# Altium schematic sheet AUTMan_DXL_SCH.SchDoc: AUTMan USBzDXL Module
size A; DrawnBy: Mojtaba Karimi; Engineer: Mojtaba Karimi; Organization: AUTMan TEAM; Address1: 3 Minna Close; Address2: Amirkabir University of Technology; Address3: Tehran; Address4: IRAN; DocumentNumber: NO.1; Revision: v.1.00; SheetNumber: 1; SheetTotal: 1
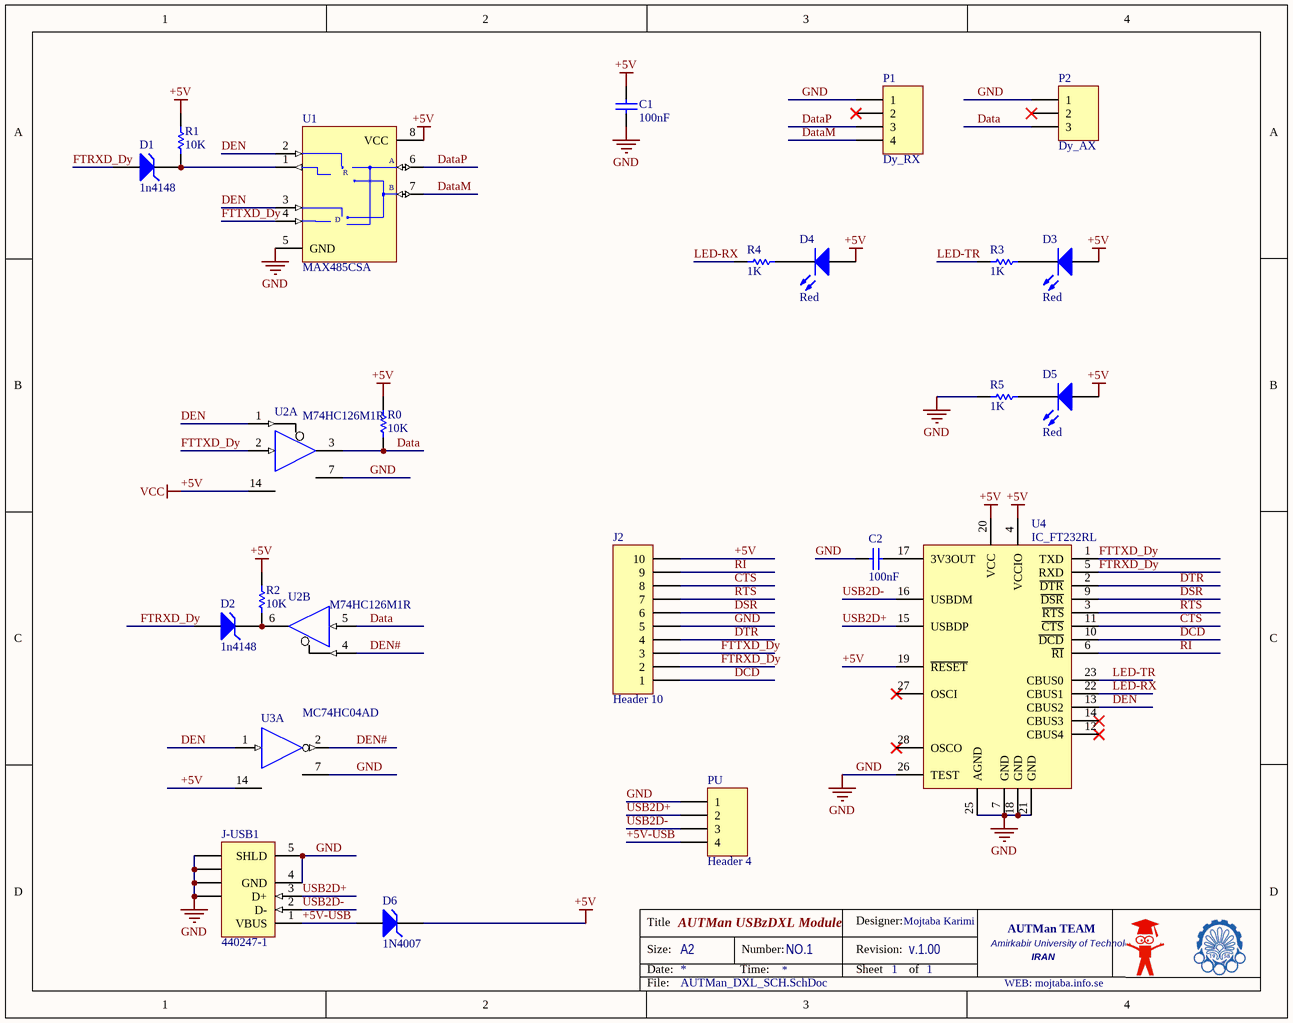
[diagram p0: AUTMan_DXL_SCH.SchDoc]

## Parts
C1  100nF  [CAPC3216L]
C2  100nF  [CAPC3216L]
D1  1n4148  [DL-35]
D2  1n4148  [DL-35]
D3  Red  [DSO-C2/D5.6]
D4  Red  [DSO-C2/D5.6]
D5  Red  [DSO-C2/D5.6]
D6  1N4007  [MELF]
J2  Header 10  [HDR1X10]
J-USB1  440247-1  [440247]
P1  Dy_RX  [HDR1X4]
P2  Dy_AX  [HDR1X3]
PU  Header 4  [HDR1X4]
R0  10K  [RESC3216L]
R1  10K  [RESC3216L]
R2  10K  [RESC3216L]
R3  1K  [RESC3216L]
R4  1K  [RESC3216L]
R5  1K  [RESC3216L]
U1  MAX485CSA  [NSO8_N]
U2  M74HC126M1R  [SO14_N]  (parts A,B of 4)
U3  MC74HC04AD  [751A-02_N]  (part A of 6)
U4  IC_FT232RL  [SSOP-28]

## Nets
+5V: C1.1 D3.1(A) D4.1(A) D5.1(A) D6.2(K) J2.10 R0.2 R1.2 R2.2 U1.8(VCC) U2.14(+5V) U3.14(VDD) U4.4(VCCIO) U4.19(~{RESET}) U4.20(VCC)  [also labelled VCC]
GND: C1.2 C2.1 J2.5 J-USB1.4(GND) J-USB1.5(SHLD) J-USB1.6(SHLD) J-USB1.7(SHLD) J-USB1.8(SHLD) J-USB1.9(SHLD) P1.1 P2.1 PU.1 R5.2 U1.5(GND) U2.7(GND) U3.7(GND) U4.7(GND) U4.18(GND) U4.21(GND) U4.25(AGND) U4.26(TEST)
NC: U4.8(NC) U4.24(NC)
+5V-USB: D6.1(A) J-USB1.1(VBUS) PU.4
CTS: J2.8 U4.11(~{CTS})
Data: P2.3 R0.1 U2.3(Y) U2.5(A)
DataM: P1.4 U1.7(B)
DataP: P1.3 U1.6(A)
DCD: J2.1 U4.10(~{DCD})
DEN: U1.2(~{RE}) U1.3(DE) U2.1(OE) U3.1(A) U4.13(CBUS2)
DEN#: U2.4(OE) U3.2(Y)
DSR: J2.6 U4.9(~{DSR})
DTR: J2.4 U4.2(~{DTR})
FTRXD_Dy: D1.1(A) D2.1(A) J2.2 U4.5(RXD)
FTTXD_Dy: J2.3 U1.4(DI) U2.2(A) U4.1(TXD)
LED-RX: R4.2 U4.22(CBUS1)
LED-TR: R3.2 U4.23(CBUS0)
RI: J2.9 U4.6(~{RI})
RTS: J2.7 U4.3(~{RTS})
USB2D+: J-USB1.3(D+) PU.2 U4.15(USBDP)
USB2D-: J-USB1.2(D-) PU.3 U4.16(USBDM)
NetC2_2: C2.2 U4.17(3V3OUT)
NetD1_2: D1.2(K) R1.1 U1.1(RO)
NetD2_2: D2.2(K) R2.1 U2.6(Y)
NetD3_2: D3.2(K) R3.1
NetD4_2: D4.2(K) R4.1
NetD5_2: D5.2(K) R5.1

Not connected (* = marked no-connect by the designer): P1 2*; P2 2*; U4 12(CBUS4)* 14(CBUS3)* 27(OSCI)* 28(OSCO)*

## Notes on the sheet
- Title
- Size:
- Date:
- A2
- Time:
- Number:
- Revision:
- Sheet
- Designer:
- Mojtaba Karimi
- of
- File:
- WEB: mojtaba.info.se
- (in symbol MAX485CSA) R; D

## Library data of the parts
C1 C2 = Cap Semi: Capacitor (Semiconductor SIM Model); Published: 8-Jun-2000; LatestRevisionDate: 29-May-2009; LatestRevisionNote: IPC-7351 Footprint Added.; PackageReference: C1206; Publisher: Altium Limited; PackageDescription: Chip Capacitor; Value: 100nF
D1 D2 = DL5233B: Silicon Zener Diode; Published: 8-Jun-2000; LatestRevisionDate: 19-Mar-2004; LatestRevisionNote: Silkscreen size reduced.; PackageReference: DL-35; Publisher: Altium Limited; ComponentLink1Description: Manufacturer Link; ComponentLink1URL: http://www.vishay.com/
D3-D5 = LED3: Typical BLUE SiC LED; Published: 8-Jun-2000; LatestRevisionDate: 17-Dec-2003; LatestRevisionNote: PCB Footprint replaced.; DatasheetVersion: 16-Apr-2002; PackageVersion: 16-Apr-2002; PackageReference: 3.5X2.8X1.9; Publisher: Altium Limited
D6 = ZMU100: High-Voltage Power Zener Diode; Published: 8-Jun-2000; LatestRevisionDate: 19-Mar-2004; LatestRevisionNote: Silkscreen size reduced.; DatasheetDocument: 16-May-1997; PackageDocument: May-1997; PackageReference: MELF; Publisher: Altium Limited; ComponentLink1Description: Manufacturer Link; ComponentLink1URL: http://www.vishay.com/
J2 = Header 10: Header, 10-Pin; LatestRevisionDate: 17-Jul-2002; LatestRevisionNote: Re-released for DXP Platform.; Publisher: Altium Limited
J-USB1 = 440247-1: USB 2.0, Right Angle, SMT, B Type, Receptacle, 5 Position, Black; ContactMaterial: Copper Alloy; ContactPlating: Gold (30); PCB_Layout: Complies with manufacturer's recommendation.; DrillSize: Corresponds to nominal value.; PanelGround: Without; Published: 15-Jul-2004; DatasheetDocument: 27-Jun-2003; PackageDocument: 27-Jun-2003; PackageReference: 440247; Publisher: Altium Limited; HousingMaterial: Thermoplastic; ComponentLink1Description: Manufacturer Link; ComponentLink1URL: http://www.tycoelectronics.com/; ComponentLink2Description: Packaging Specification; ComponentLink2URL: http://ecommas.tycoelectronics.com/commerce/DocumentDelivery/DDEController?Action=showdoc&DocId=Customer+Drawing%7F440247%7FD%7Fpdf%7FEnglish%7FC_440247_D.pdf
P1 PU = Header 4: Header, 4-Pin; LatestRevisionDate: 17-Jul-2002; LatestRevisionNote: Re-released for DXP Platform.; Publisher: Altium Limited
P2 = Header 3: Header, 3-Pin; LatestRevisionDate: 17-Jul-2002; LatestRevisionNote: Re-released for DXP Platform.; Publisher: Altium Limited
R0-R2 = ERJ6RS: Low Ohmic Value Thick Film Chip Resistor, 0.1 Ohm to 0.2 Ohm Range, 1%, 2% and 5% Tolerance, 0805 Size, 0.125 W; Published: 17-Dec-2003; LatestRevisionDate: 19-Mar-2004; LatestRevisionNote: Silkscreen size reduced.; PackageDocument: Mar-2003; PackageReference: 6-0805; Publisher: Altium Limited; Code_IPC: 2012 [0805]; ComponentLink1Description: Manufacturer Link; ComponentLink1URL: http://www.panasonic.com/industrial/components/resistive_products.htm; ComponentLink2Description: Datasheet; ComponentLink2URL: http://www.panasonic.com/industrial/components/pdf/AOA0000CE3.pdf
R3-R5 = Res Semi: Semiconductor Resistor; Published: 8-Jun-2000; LatestRevisionDate: 17-Jul-2002; LatestRevisionNote: Re-released for DXP Platform.; PackageReference: AXIAL-0.5; Publisher: Altium Limited; Value: 1K
U1 = MAX485CSA: Low-Power, Slew-Rate-Limited RS-485/RS-422 Transceiver; Published: 16-Jan-2001; LatestRevisionDate: 13-Apr-2006; LatestRevisionNote: IPC-7351 Footprint Added.; DatasheetVersion: Feb-1996; PackageReference: NSO8; Publisher: Altium Limited; PackageDescription: 8-Pin Small Outline Integrated Circuit 1.27 mm Pitch; Code_JEDEC: MS-012-AA; Code_IPC: SOIC127P600-8; ComponentLink1Description: Manufacturer Link; ComponentLink1URL: http://www.maxim-ic.com/; ComponentLink2Description: Datasheet; ComponentLink2URL: http://pdfserv.maxim-ic.com/en/ds/MAX1487-MAX491.pdf
U2 = M74HC126M1R: Quad Bus Buffer (3-State); Published: 8-Jun-2000; LatestRevisionDate: 13-Apr-2006; LatestRevisionNote: IPC-7351 Footprint Added.; DatasheetVersion: Sep-1993; PackageVersion: Sep-1998; PackageReference: SO14; Publisher: Altium Limited; PackageDescription: 14-Pin Small Outline Integrated Circuit 1.27 mm Pitch; Code_IPC: SOIC127P600-14; ComponentLink1Description: Manufacturer Link; ComponentLink1URL: http://www.st.com/; ComponentLink2Description: Datasheet; ComponentLink2URL: http://www.st.com/stonline/products/literature/ds/8021/m74hc126.pdf
U3 = MC74HC04AD: Hex Inverter; Published: 17-Jul-2002; LatestRevisionDate: 13-Apr-2006; LatestRevisionNote: IPC-7351 Footprint Added.; DatasheetVersion: 1989; PackageVersion: 1991; PackageReference: 751A-02; Publisher: Altium Limited; PackageDescription: 14-Pin Small Outline Integrated Circuit 1.27 mm Pitch; Code_IPC: SOIC127P600-14; ComponentLink1Description: Manufacturer Link; ComponentLink1URL: http://www.onsemi.com/site/products/parametrics/0,4446,247,00.html; ComponentLink2Description: Ibis Model; ComponentLink2URL: http://www.onsemi.com/pub/Collateral/MC54HC04AJ.IBS
U4 = IC_FT232RL: FT232R USB UART; Manufacturer: *; Note: *; ManufacturerPartNo: *